# EAGLE design hvreg (EAGLE 7.2.0)
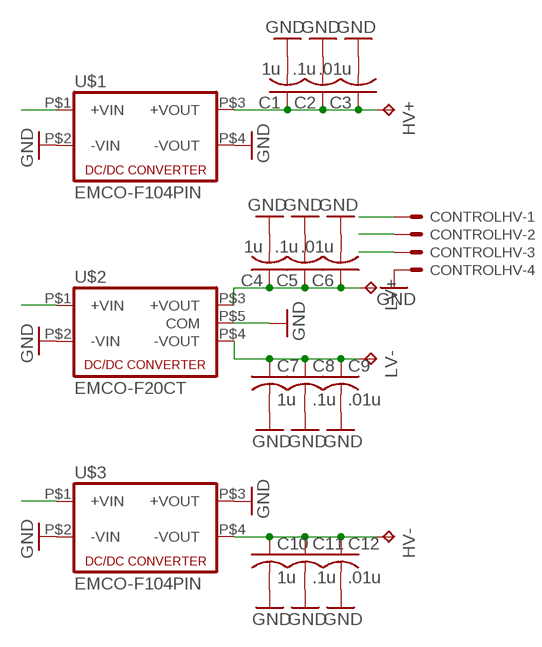
[diagram p0: schematic, sheet 1]

## Parts
C1  1u  C-US275-113X316  [C275-113X316]
C2  .1u  C-US102-043X133  [C102-043X133]
C3  .01u  C-US075-042X103  [C075-042X103]
C4  1u  C-US275-113X316  [C275-113X316]
C5  .1u  C-US102-043X133  [C102-043X133]
C6  .01u  C-US075-042X103  [C075-042X103]
C7  1u  C-US275-113X316  [C275-113X316]
C8  .1u  C-US102-043X133  [C102-043X133]
C9  .01u  C-US075-042X103  [C075-042X103]
C10  1u  C-US275-113X316  [C275-113X316]
C11  .1u  C-US102-043X133  [C102-043X133]
C12  .01u  C-US075-042X103  [C075-042X103]
CONTROLHV  KK-156-4  [KK-156-4]
HV+  TPPAD1-20Y  [P1-20Y]
HV-  TPPAD1-20Y  [P1-20Y]
LV+  TPPAD1-20Y  [P1-20Y]
LV-  TPPAD1-20Y  [P1-20Y]
U$1  EMCO-F104PIN  [EMCO-F]
U$2  EMCO-F20CT  [EMCO-F*CT]
U$3  EMCO-F104PIN  [EMCO-F]

## Nets
GND: C1.2 C2.2 C3.2 C4.2 C5.2 C6.2 C7.2 C8.2 C9.2 C10.2 C11.2 C12.2 CONTROLHV.4 U$1.P$2(-VIN) U$1.P$4(-VOUT) U$2.P$2(-VIN) U$2.P$5(COM) U$3.P$2(-VIN) U$3.P$3(+VOUT)
N$1: C1.1 C2.1 C3.1 HV+.TP U$1.P$3(+VOUT)
N$2: C10.1 C11.1 C12.1 HV-.TP U$3.P$4(-VOUT)
N$5: C4.1 C5.1 C6.1 LV+.TP U$2.P$3(+VOUT)
N$6: C7.1 C8.1 C9.1 LV-.TP U$2.P$4(-VOUT)
VREG1: CONTROLHV.1 U$1.P$1(+VIN)
VREG2: CONTROLHV.2 U$2.P$1(+VIN)
VREG3: CONTROLHV.3 U$3.P$1(+VIN)

## Library data of the parts
C1-C12 = rcl:C-US: CAPACITOR, American symbol
CONTROLHV = con-molex:KK-156-4: KK 156 HEADER Source: http://www.molex.com/pdm_docs/sd/026604100_sd.pdf; OC_FARNELL: unknown; OC_NEWARK: unknown
HV+ HV- LV+ LV- = testpad:TP: Test pad
U$1 U$3 = dc-dc-converter:EMCO-F10
U$2 = dc-dc-converter:EMCO-F20CT

## Board
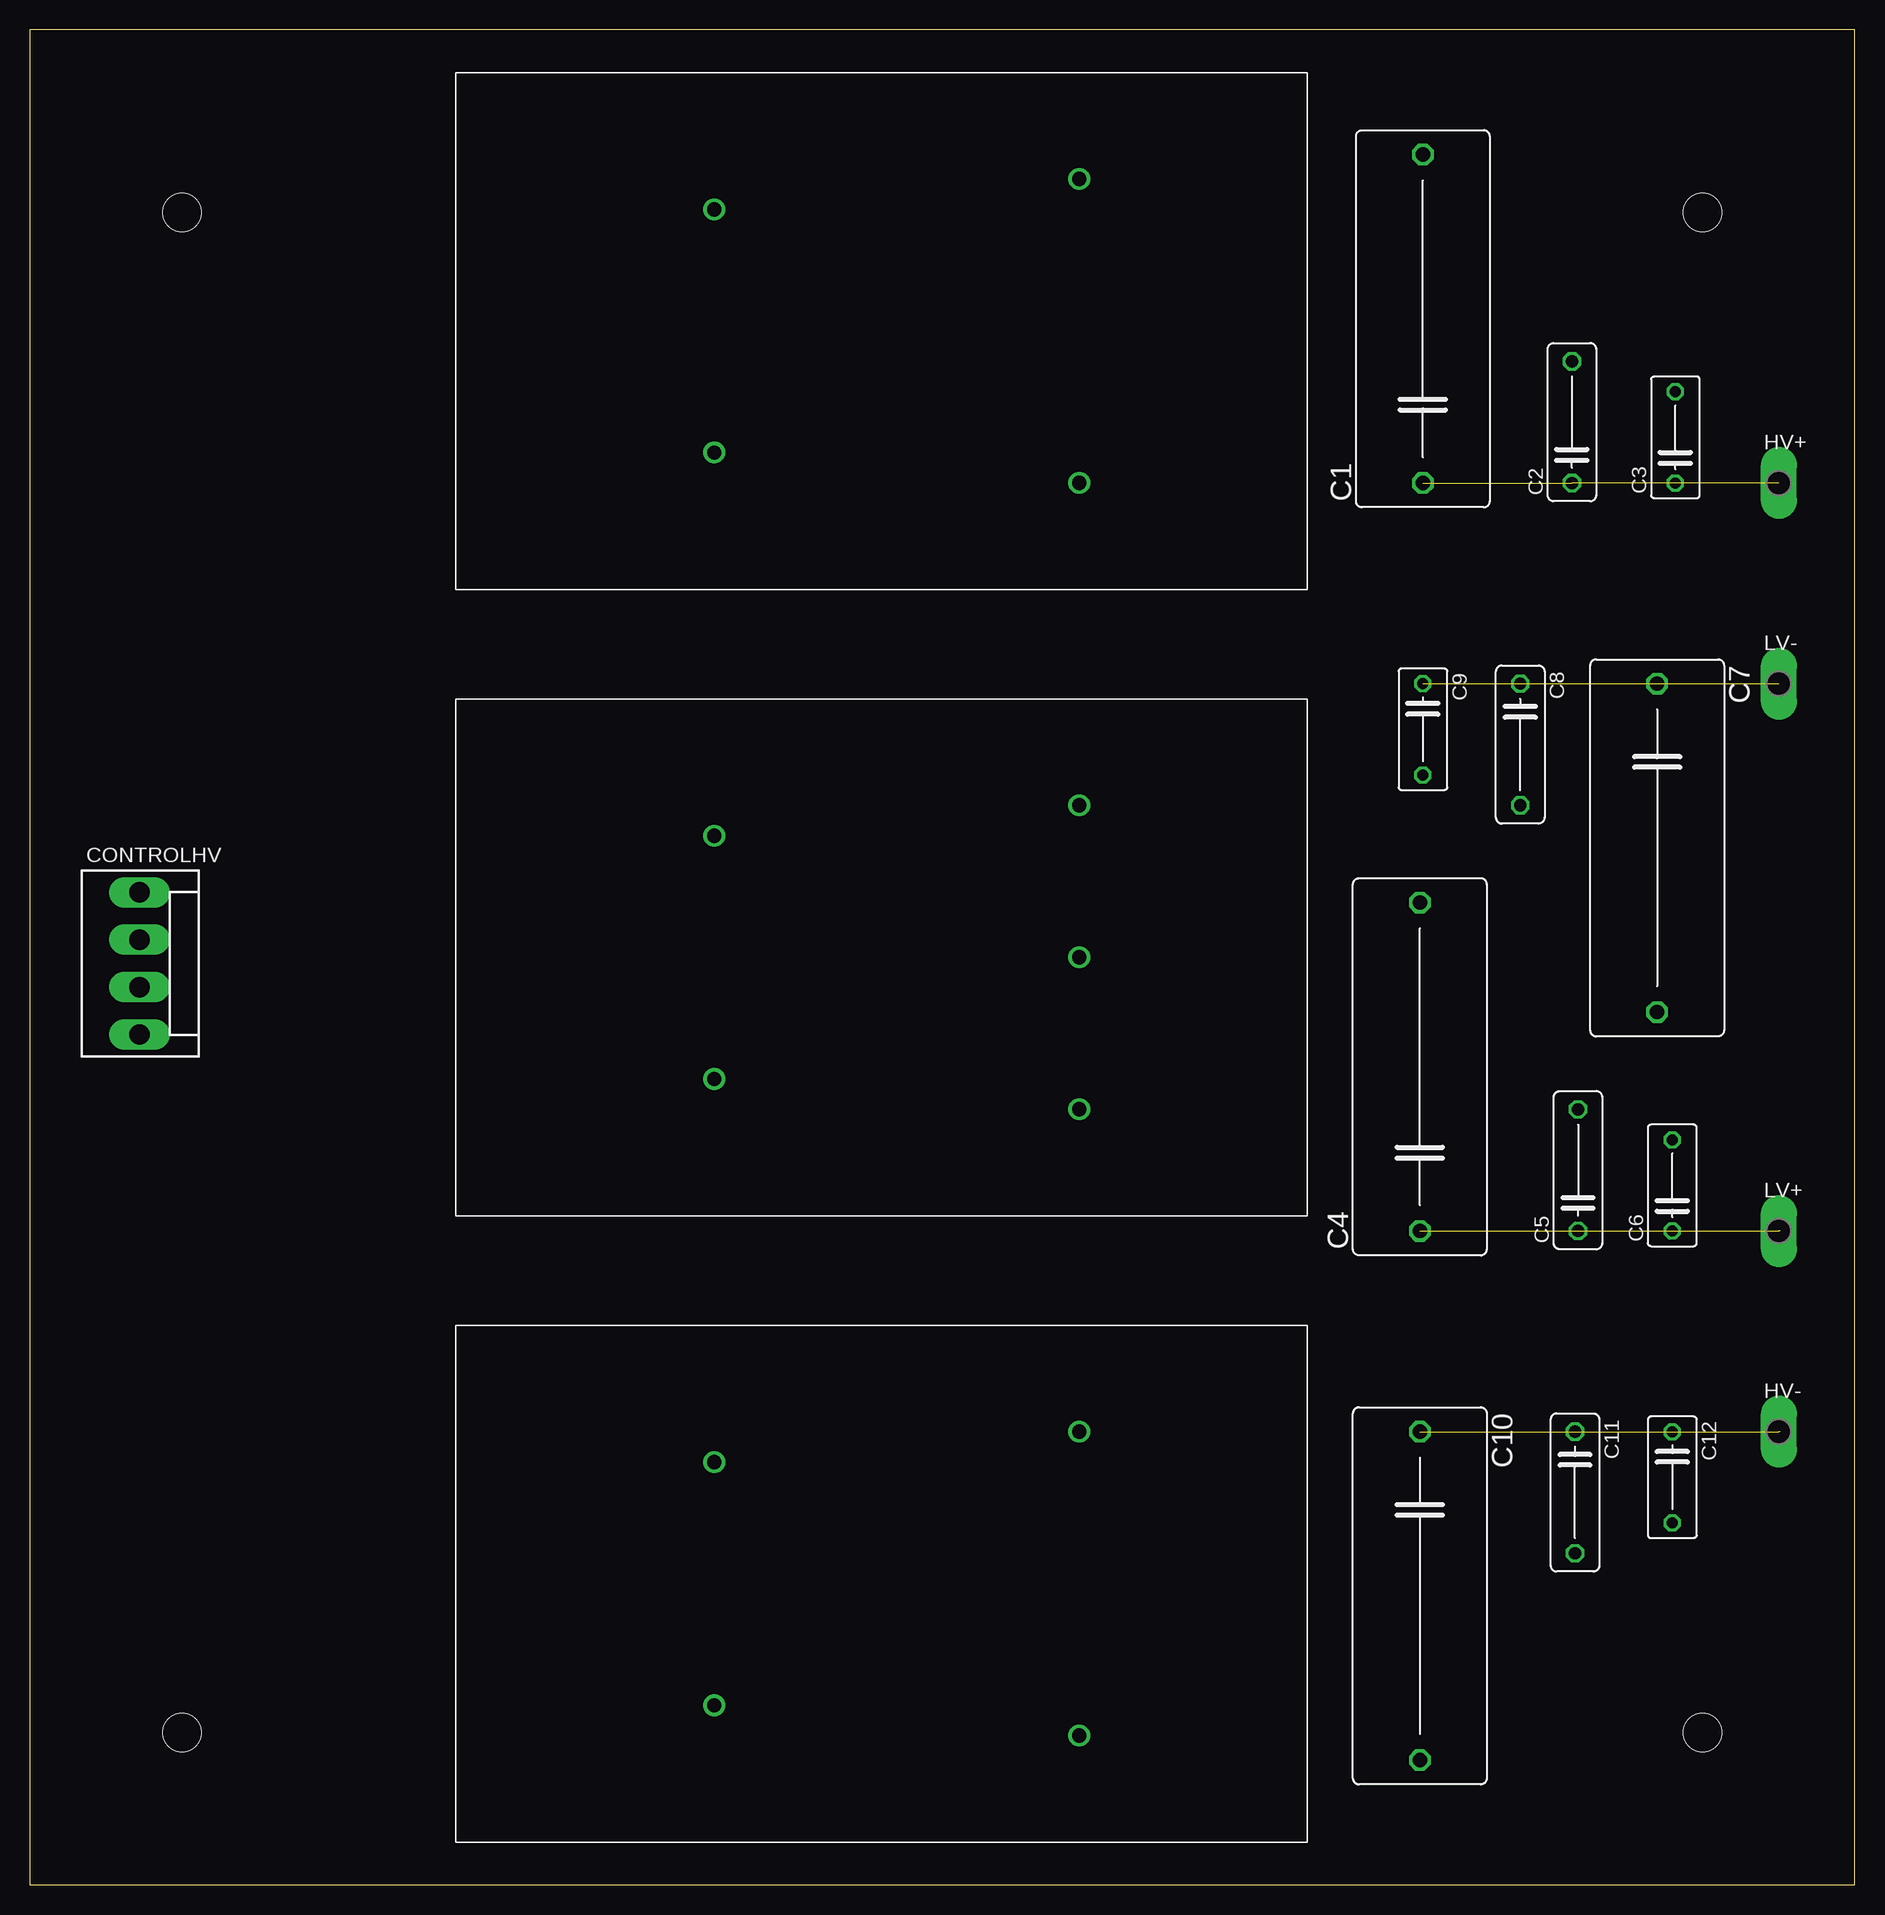
[diagram p1: board, top side]
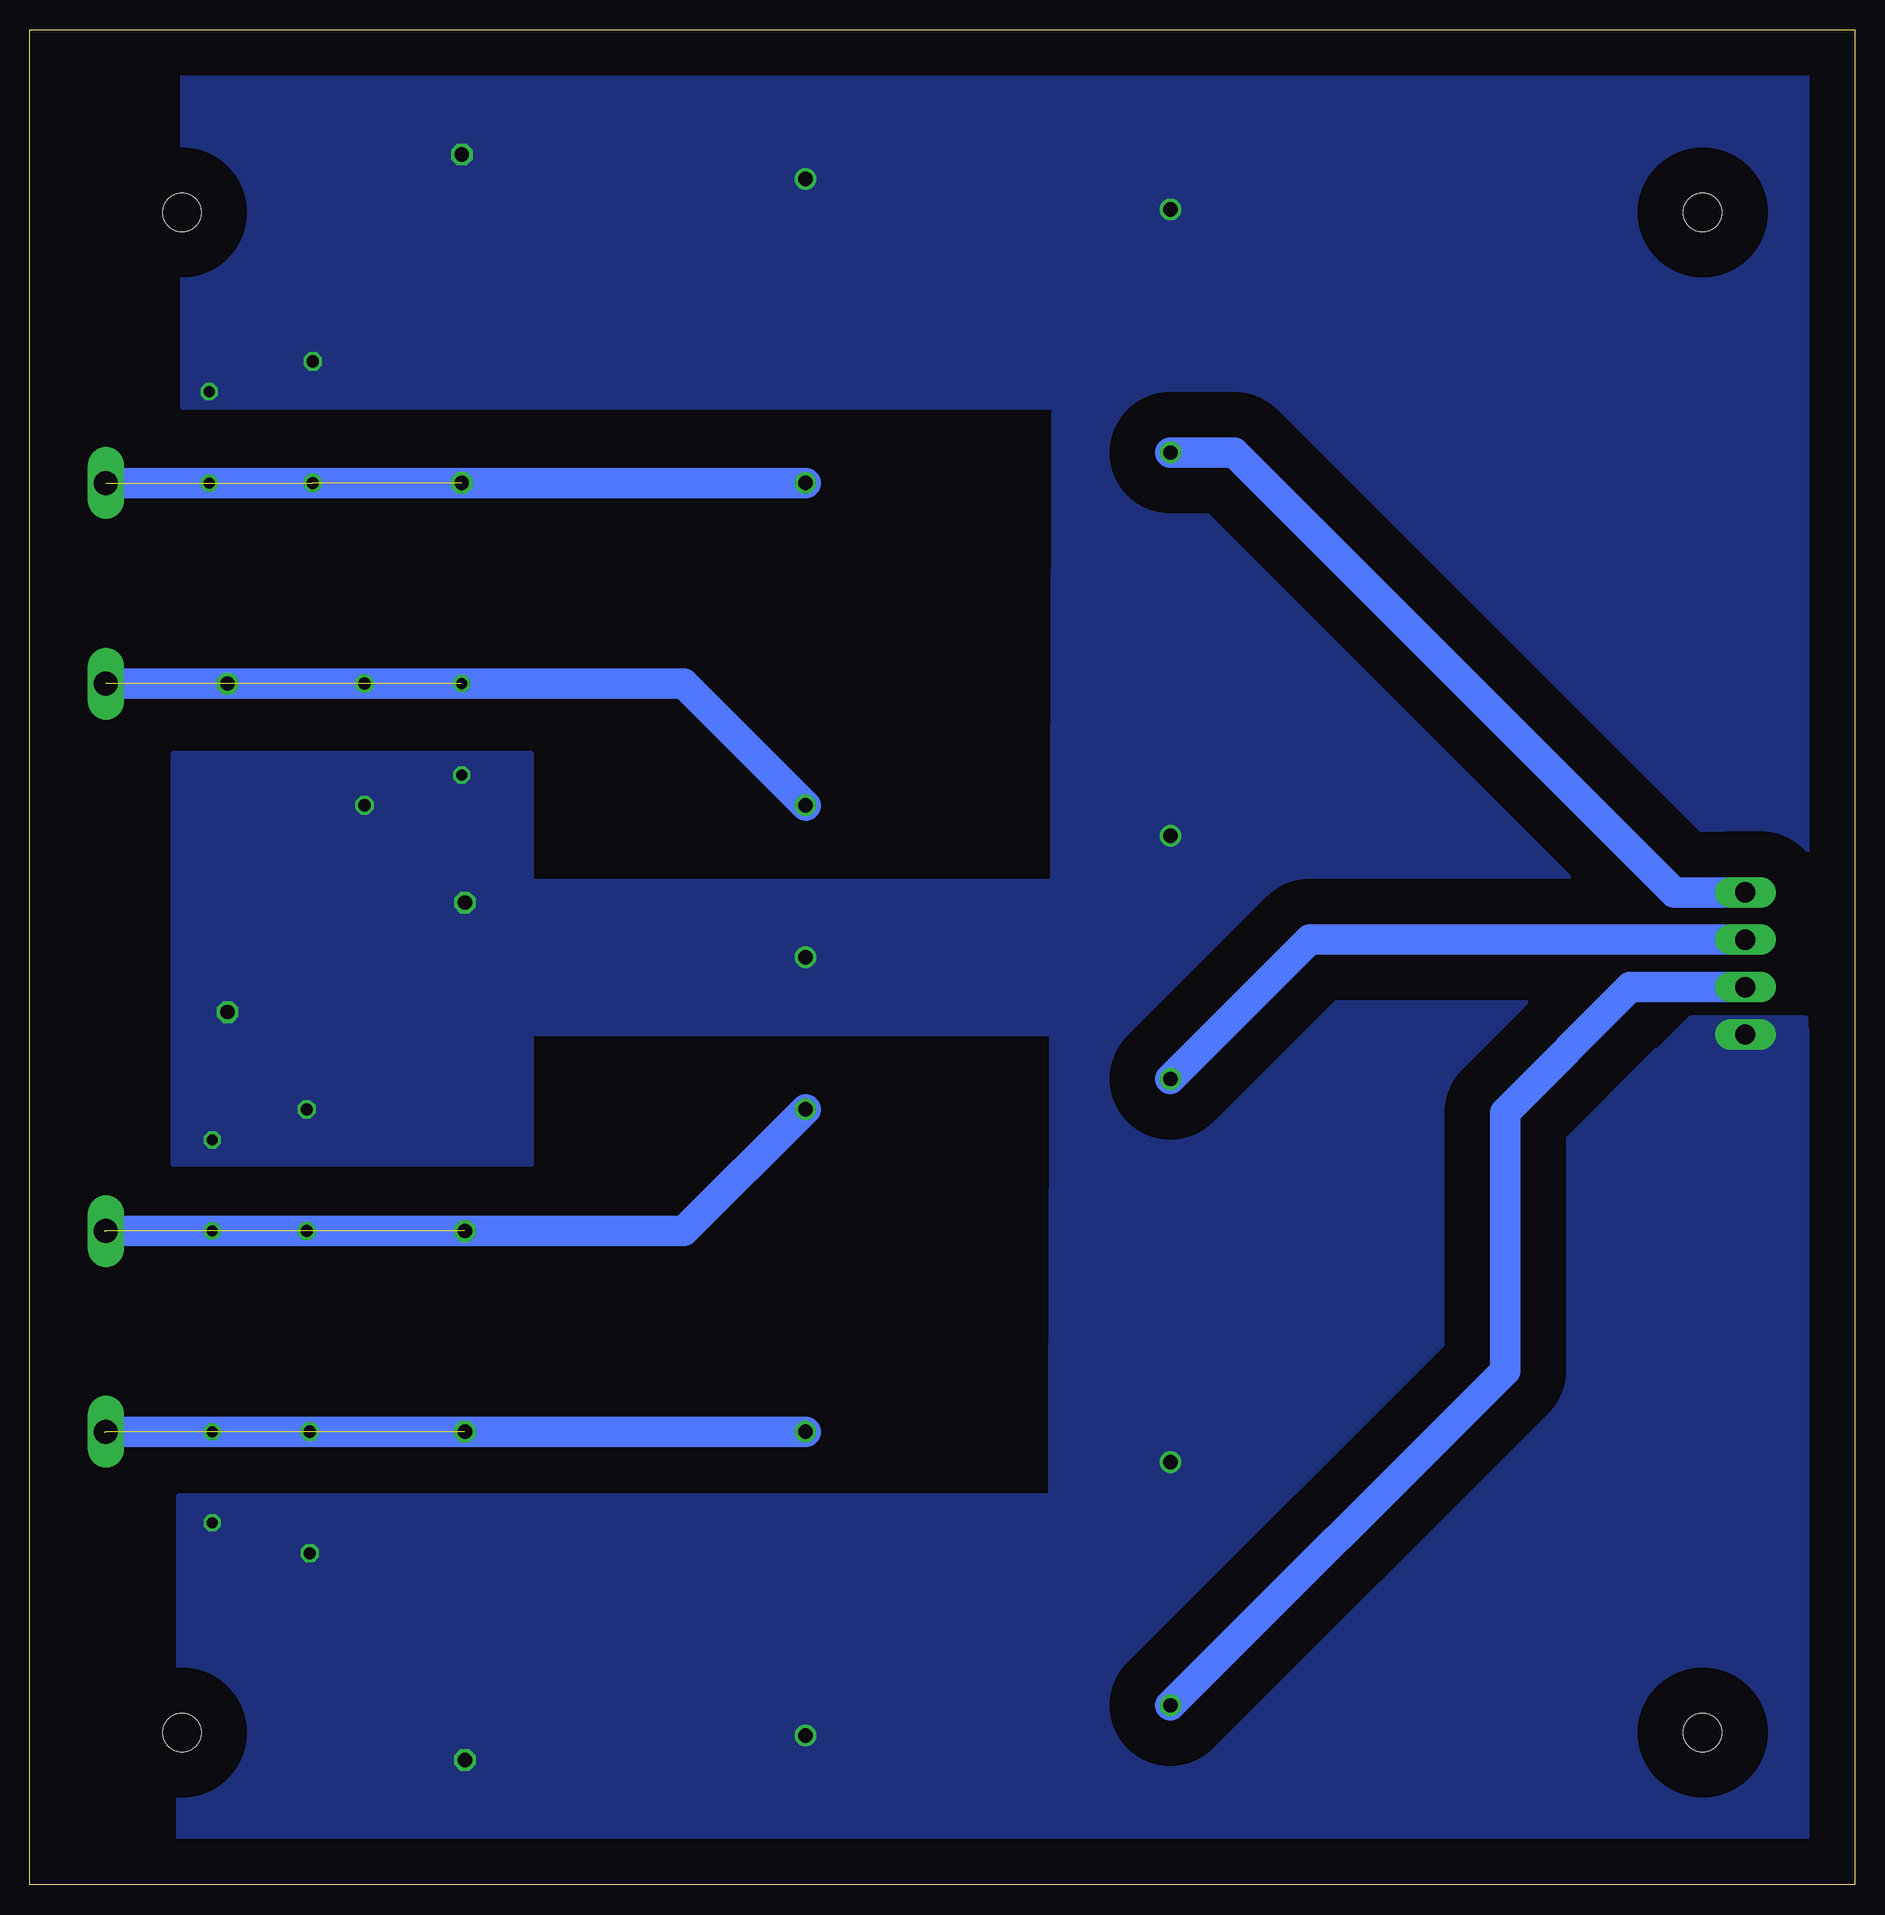
[diagram p2: board, bottom side, seen from below]

Size 152.4 x 154.96 mm. Coordinates in mm from the lower left corner, seen from the top.
Outline: 0,0.02 152.4,0 152.4,154.96 0,154.96 0,0.02
Copper layers (1*16): Top 0.035mm / dielectric 1.5mm / Bottom 0.035mm
Design rules "default": minimum track width 10mil, minimum drill 24mil, track to track 8mil, track to pad 8mil, pad to pad 8mil, via to via 8mil, smd to smd 8mil, copper to edge 40mil, drill to drill 8mil, minimum pad ring 10mil, minimum via ring 8mil, stop-mask expansion 4mil, vias tented up to drill 0mil, thermal gap 10mil
Holes 3.2 mm at 139.7,12.72 139.7,139.72 12.7,12.72 12.7,139.72

### Footprints (pad centres in the part's own frame; a part is rotated, then mirrored left to right if it is on the bottom)
C275-113X316 = drill 1.194 octagon: 1 -13.716,0; 2 13.716,0
C102-043X133 = drill 1.016 octagon: 1 -5.08,0; 2 5.08,0
C075-042X103 = drill 0.914 octagon: 1 -3.81,0; 2 3.81,0
KK-156-4 = drill 1.7 pad 2.184 long: 1 -5.94,0; 2 -1.98,0; 3 1.98,0; 4 5.94,0
P1-20Y = drill 2.007 pad 2.54 long: TP 0,0
EMCO-F = drill 1.2: P$1 0,0; P$2 0,20.32; P$3 30.48,-2.54; P$4 30.48,22.86
EMCO-F*CT = drill 1.2: P$1 0,0; P$2 0,20.32; P$3 30.48,-2.54; P$4 30.48,22.86; P$5 30.48,10.16

### Placement (x,y rotation side)
C1  116.33,130.83 90 top
C2  128.78,122.19 90 top
C3  137.41,120.92 90 top
C4  116.08,68.35 90 top
C5  129.29,59.71 90 top
C6  137.16,58.44 90 top
C7  135.89,86.63 270 top
C8  124.46,95.27 270 top
C9  116.33,96.54 270 top
C10  116.08,24.15 270 top
C11  129.03,32.79 270 top
C12  137.16,34.06 270 top
CONTROLHV  9.14,76.98 270 top
HV+  146.05,117.11 0 top
HV-  146.05,37.87 0 top
LV+  146.05,54.63 0 top
LV-  146.05,100.35 0 top
U$1  57.15,119.65 0 top
U$2  57.15,67.33 0 top
U$3  57.15,15.01 0 top

### Tracks (layer width: path | path; a pad name or v marks a point on that pad's centre or on a via)
GND
  pour Bottom (isolate 3.81, no thermals): 0,154.96 66.8,155.21 67.31,0.02 0,0.02
  pour Bottom (no thermals): 4.06,72.41 13.72,72.41 17.02,69.11 4.06,69.11
  pour Bottom (isolate 3.81, no thermals): 66.55,154.96 139.7,154.96 139.7,123.46 66.55,123.46
  pour Bottom (isolate 3.81, no thermals): 66.04,83.84 110.49,83.84 110.49,94.51 140.46,94.51 140.46,60.22 110.49,60.22 110.49,71.14 66.04,71.14
  pour Bottom (isolate 3.81, no thermals): 139.7,32.53 66.29,32.53 66.29,0.02 139.95,0.02 139.95,32.53
N$1  (3 unrouted)
  Bottom 2.54: U$1.P$3 HV+.TP
N$2  (4 unrouted)
  Bottom 2.54: U$3.P$4 146.18,37.87
N$5  (4 unrouted)
  Bottom 2.54: U$2.P$3 97.79,54.63 146.18,54.63
N$6  (4 unrouted)
  Bottom 2.54: U$2.P$4 97.79,100.35 145.92,100.35
VREG1
  Bottom 2.54: CONTROLHV.1 15.08,82.92 51.82,119.65 U$1.P$1
VREG2
  Bottom 2.54: CONTROLHV.2 45.52,78.96 U$2.P$1
VREG3
  Bottom 2.54: CONTROLHV.3 18.74,75 29.21,64.54 29.21,42.95 U$3.P$1